# Altium schematic sheet LEDblinker_sche.SchDoc
size A; SheetNumber: 1; SheetTotal: 1
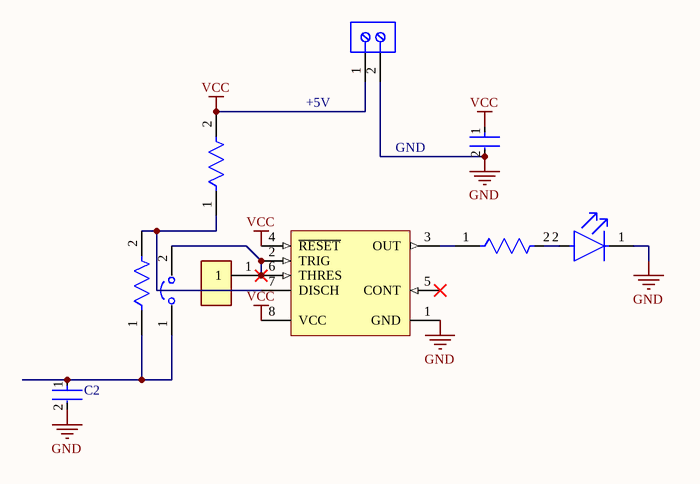
[diagram p0: LEDblinker_sche.SchDoc]

## Parts
C1  C0402C103M8RACTU  [FP-C0402-BB-MFG]  (value not drawn)
C2  GCJ31CD7YA106KE02L  [FP-GCJ31C-0_4-IPC_C]  (value not drawn)
D1  SSL-LX5093YD  [FP-SSL-LX5093YD-MFG]  (value not drawn)
J1  1725656  [PHOE-1725656-2]  (value not drawn)
J2  S1911-46R  [FP-S1911-46R-MFG]  (value not drawn)
J3  999-11-110-10-000000  [FP-999-11-110-10-000000-MFG]  (value not drawn)
R1  RT0402DRE0747KL  [FP-RT0402-MFG]  (value not drawn)
R2  RMCF0603JG470R  [FP-RMCF0603-IPC_B]  (value not drawn)
R3  RT0402DRE0747KL  [FP-RT0402-MFG]  (value not drawn)
U1  NE555DR  [D0008A_N]  (value not drawn)

## Nets
GND: C1.2 C2.2 D1.1(C) J1.2 U1.1(GND)
VCC: C1.1 J1.1 R1.2 U1.4(~{RESET}) U1.8(VCC)
NetC2_1: C2.1 J2.1 R3.1
NetD1_2: D1.2(A) R2.2
NetJ2_2: J2.2 J3.1 U1.2(TRIG) U1.6(THRES)
NetR1_1: R1.1 R3.2 U1.7(DISCH)
NetR2_1: R2.1 U1.3(OUT)

Not connected (* = marked no-connect by the designer): U1 5(CONT)*

## Notes on the sheet
- +5V
- GND

## Library data of the parts
C1 = CMP-2008-03079-2: CAP CER 10000PF 10V X7R 0402; Manufacturer: Kemet; Tolerance: 0.2; Material: Ceramic; Temperature Coefficient: 15%; Value: 10,000 pF; Voltage Rating: 10 V; ComponentLink2URL: https://content.kemet.com/datasheets/KEM_C1002_X7R_SMD.pdf; Octopart: https://octopart.com/c0402c103m8ractu-kemet-12595671; RoHS: TRUE; Automotive: No; Category: Cap; Temperature Range Low: -55°C; Package: C0402-BB; Lead Free: Yes; Ipc Land Pattern Name: CAPC10050X50; Height: 0.55mm; ComponentLink2Description: Datasheet; Temperature Characteristic: X7R; Mouser Description: Multilayer Ceramic Capacitors MLCC - SMD/SMT 10volts 10000pF X7R 20%; Manufacturer Part Number: C0402C103M8RACTU; Temperature Range High: +125°C; Digikey Description: CAP CER 10000PF 10V X7R 0402; Device Class L1: Passive Components; Capacitance: 10,000 pF; Temperature: -55°C to +125°C; Device Class L3: Ceramic Capacitors; Device Class L2: Capacitors
C2 = CMP-06035-004889-1: Cap Ceramic 10uF 35V X7T 10% SMD 1206 +125°C Embossed Plastic T/R
D1 = CMP-57192-000007-1: LED YELLOW DIFFUSED T-1 3/4 T/H; Test Current: 20mA; Number of LEDs: 1; Dominant Wavelength: 568nm; Wavelength: 585nm; Forward Voltage: 2.1V; Lens Style: Dome; Viewing Angle: 60°; Luminous Intensity: 30mcd; Min Operating Temperature: -40°C; Packaging: Bulk; Width: 1.5inch; Lead Free: Lead Free; Number of Pins: 2; Color: Yellow; Case/Package: Radial; Forward Current: 20mA; REACH SVHC: No SVHC; Lens Transparency: Diffused; Weight: 0.01lb; Height: 8.6mm; Package Quantity: 1000; Series: -; Length: 0.5inch; Illumination Color: Yellow; Mount: Through Hole; Diameter: 5mm; RoHS Compliant: Yes; Lens Color: Yellow; Max Operating Temperature: 85°C
J1 = CMP-2000-05299-1: Male Header, Pitch 2.54 mm, 1 x 2 Position, Height 9 mm, Tail Length 3.5 mm; Manufacturer: Phoenix Contact; Number of contacts: 2; Content: 250pc(s); Pitch: 2.54mm; Industrial packaging: Yes; Colour: Green; Manufacturer part No.: 1725656; Type: MPT0,5/2-2,54; Datasheet URL: http://datasheet.octopart.com/1725656-Phoenix-Contact-datasheet-5302866.pdf; Manufacturer URL: http://www.phoenixcontact.com/; Datasheet Version: Apr-08
J2 = CMP-15817-000009-1: JUMPER TIN SMD; Gender: Non-Gendered; Current Rating: 10A; Number of Contacts: 2; Pitch: 0.119inch; Material: Brass; REACH SVHC: No SVHC; Number of Rows: 1; Plating: Tin; Contact Plating: Tin; Length: 6.85mm; RoHS Compliant: Yes; Height: 0.038inch; Packaging: Tape and Reel; Contact Material: Brass; Orientation: Straight; Termination: SMD/SMT; Depth: 2.51mm; Color: Silver; Number of Positions: 2; Series: S1; Package Quantity: 4000
J3 = CMP-07777-000007-1: JUMPER NON-INSULATED MALE .100"; Max Voltage Rating (DC): 150V; Max Voltage Rating (AC): 100V; Pitch: 2.54mm; Number of Positions: 1; Contact Plating: Gold; Packaging: Bulk; Number of Rows: 1; Series: 999; Housing Material: Polybutylene; Package Quantity: 1; Depth: 0.55mm; RoHS Compliant: Yes; Mount: Through Hole; Lead Free: Lead Free; Length: 3.09mm; Orientation: Straight; Height: 0.217inch
R1 R3 = CMP-03412-004316-1: RES SMD 47K OHM 0.5% 1/16W 0402; Manufacturer: Yageo; Value: 47KΩ; Temperature Coefficient: 50 ppm/°C; Power Rating: 0.063W; Voltage Rating: 50V; Tolerance: 0.005; Composition: Thin Film; Series: RT; ComponentLink2URL: http://www.yageo.com/documents/recent/PYu-RT_1-to-0.01_RoHS_L_9.pdf; Temperature Range Low: -55°C; Resistance: 47KΩ; RoHS: TRUE; Manufacturer Part Number: RT0402DRE0747KL; Automotive: No; Height: 0.35mm; Ipc Land Pattern Name: RESC10050X30; Device Class L3: Chip SMD Resistors; Category: Res; Digikey Description: RES SMD 47K OHM 0.5% 1/16W 0402; Device Class L2: Resistors; Temperature Range High: +155°C; Footprint Url: http://www.yageo.com/exep/pages/download/literatures/PYu-R_Mount_10.pdf; Package: RT0402; Lead Free: Yes; Device Class L1: Passive Components; Temperature: -55°C to +155°C; Octopart: https://octopart.com/rt0402dre0747kl-yageo-1418105; ComponentLink2Description: Datasheet
R2 = CMP-26527-007559-1: 470Ω ±5% 0.1W 0603 Thick Film Chip Resistor AEC-Q200 compliant; Resistance: 470R; Temperature Coefficient: 200ppm/°C; Max Power Dissipation: 100mW; Value: 470R; Min Operating Temperature: -55°C; Features: Automotive AEC-Q200; Packaging: Tape and Reel; Package Quantity: 10000; Number of Terminations: 2; Mount: Surface Mount; Case/Package: 0603; Radiation Hardening: No; Resistor Type: Thick Film; Width: 0.031inch; Contact Plating: Tin; Tolerance: 5%; Series: RMCF; Max Operating Temperature: 155°C; Height: 0.022inch; RoHS Compliant: Yes; Length: 0.061inch
U1 = CMP-016-00007-3: Precision Timer, 4.5 to 16 V, 0 to 70 degC, 8-Pin SOIC (D), Green (RoHS & no Sb/Br), Tape and Reel; Manufacturer: Texas Instruments; Max Ouput Current: -200mA; Frequency: 100kHz; Max Supply Voltage: 16V; Min Supply Voltage: 4.5V; Package Version: 4040047-3/M, 06/2011; Datasheet Version: SLFS022I, 09/2014; Datasheet URL: http://www.ti.com/general/docs/lit/getliterature.tsp?genericPartNumber=NE555&fileType=pdf; Package Reference: D0008A; Min Operating Temperature: 0°C; Case/Package: SOIC; Pins: 8; RoHS Compliant: True; Packaging: TapeandReel; Package Quantity: 2500; Package URL: http://www.ti.com/lit/ml/msoi002j/msoi002j.pdf; Package Description: 8-Pin Small Outline Integrated Circuit, Body 4.9 x 3.9 mm, Pitch 1.27 mm; Mounting Technology: SM; Max Operating Temperature: 70°C; Manufacturer URL: http://www.ti.com/